# EAGLE design photodiode v1 (EAGLE 9.7.0)
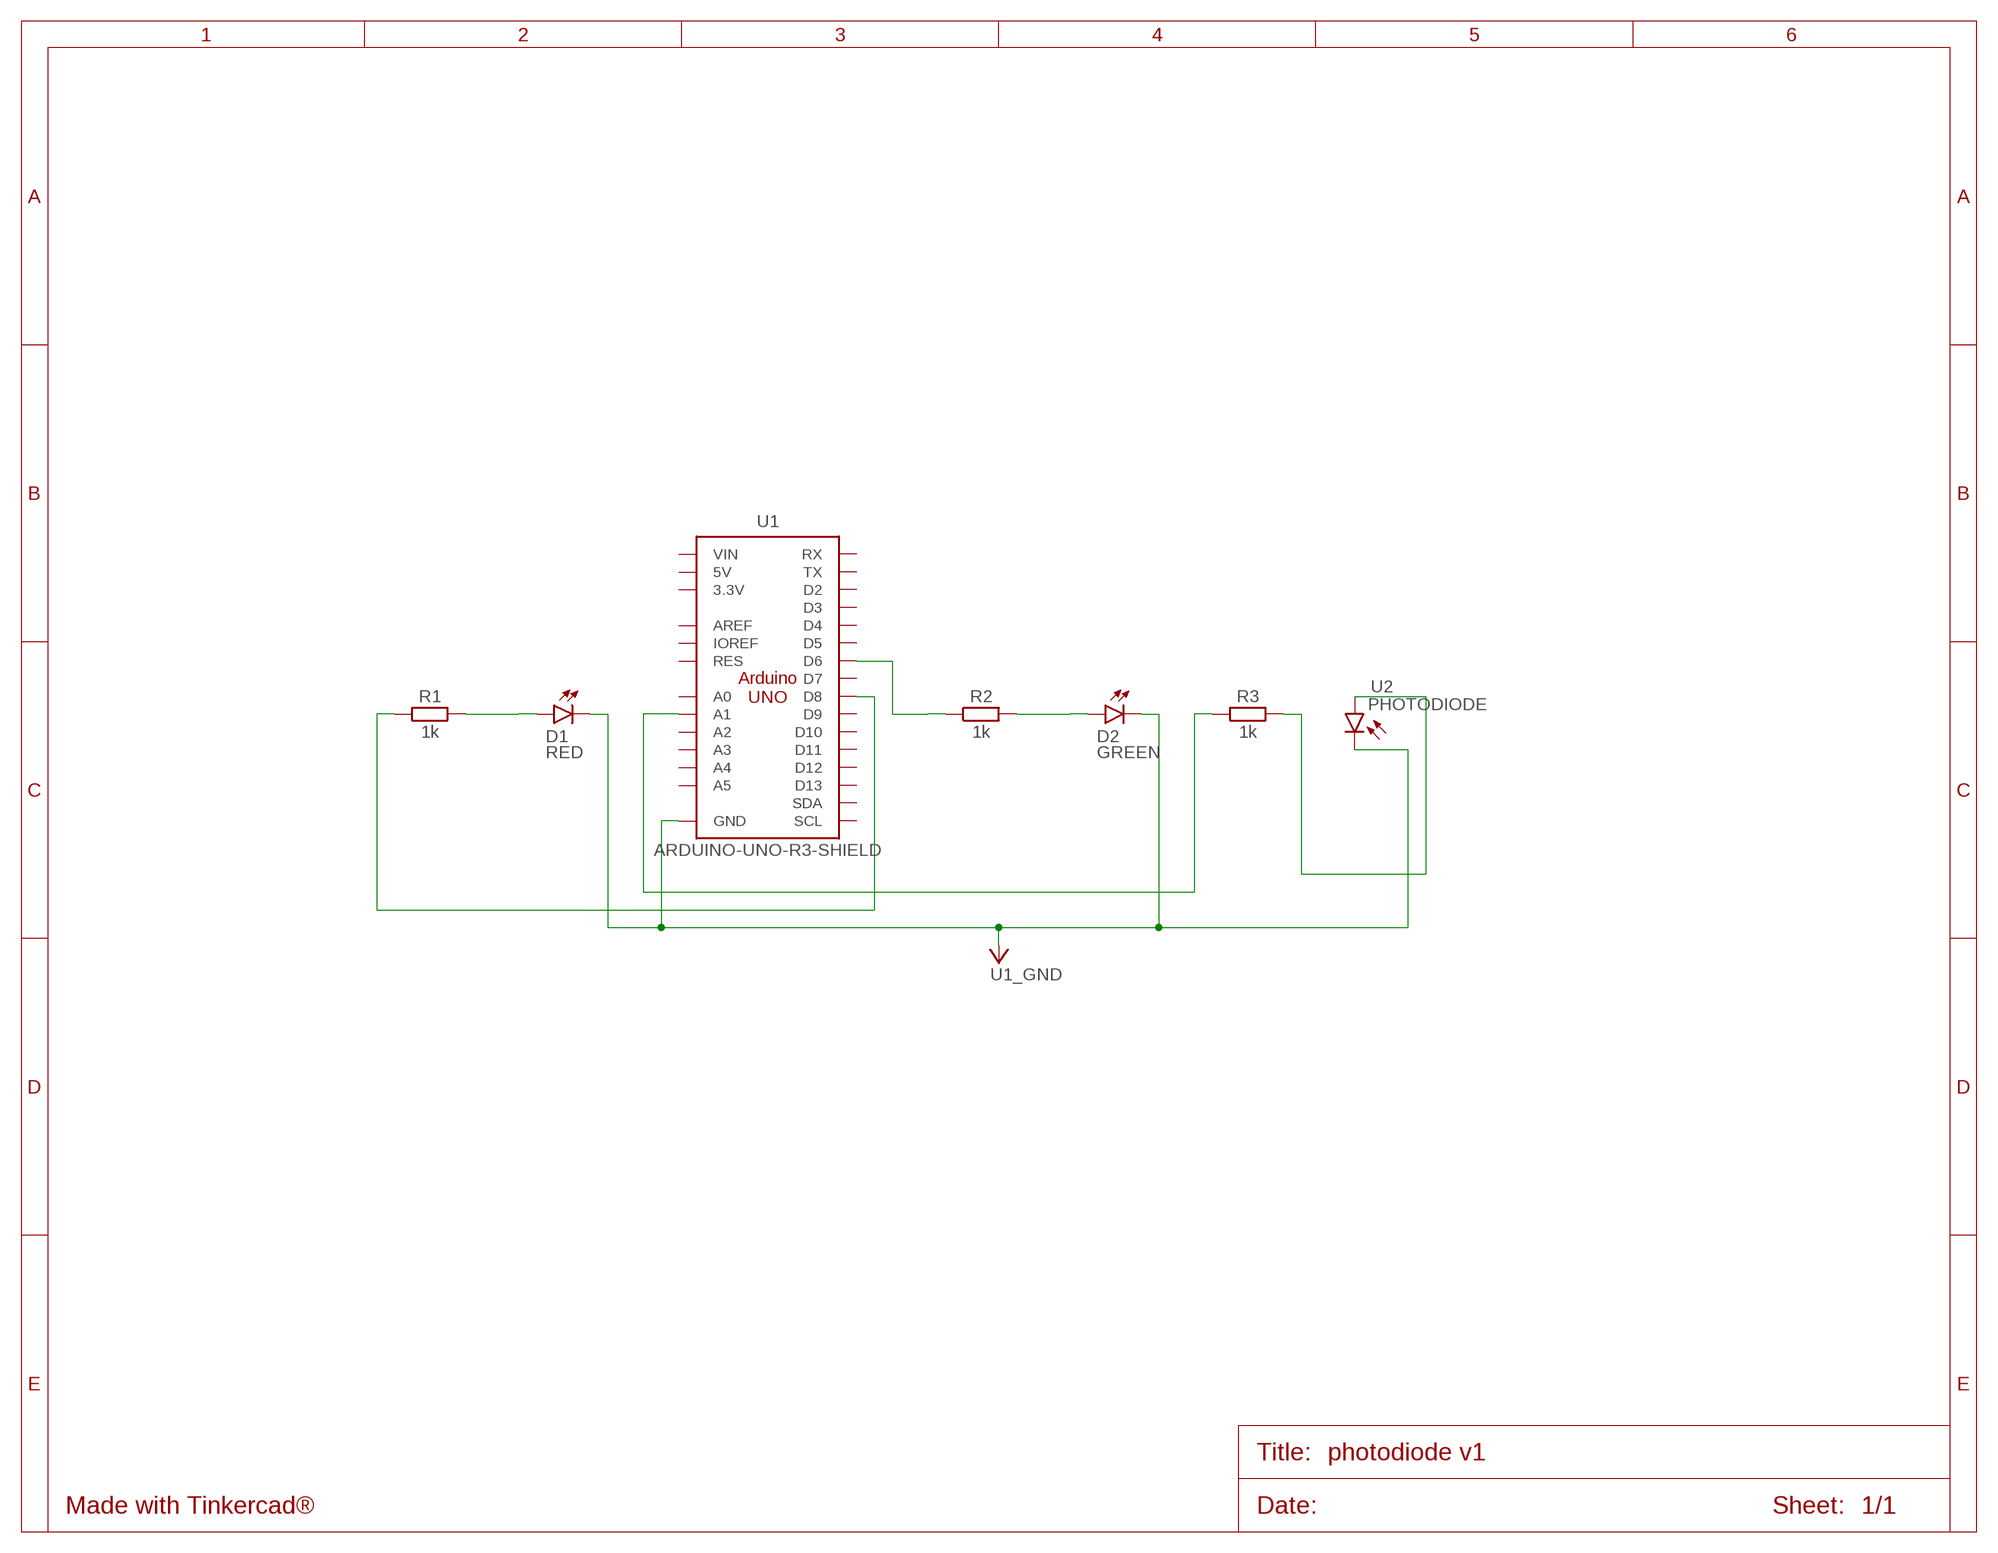
[diagram p0: schematic, sheet 1]

## Parts
D1  RED  LED_RADIAL_RED  [LEDRD254W60D565H860B]
D2  GREEN  LED_RADIAL_GREEN  [LEDRD254W60D565H860B_G]
R1  1k  RESISTOR_AXIAL-10.16MM-PITCH  [RESAD1016W63L850D250B]
R2  1k  RESISTOR_AXIAL-10.16MM-PITCH  [RESAD1016W63L850D250B]
R3  1k  RESISTOR_AXIAL-10.16MM-PITCH  [RESAD1016W63L850D250B]
U1  ARDUINO-UNO-R3-SHIELD  [ARDUINO-UNO-R3-SHIELD]
U2  PHOTODIODE  [LEDRD254W51D580H541B]

## Nets
D1_A: D1.1(A) R1.2
D2_A: D2.1(A) R2.2
U1_A1: R3.1 U1.A1
U1_D6: R2.1 U1.D6
U1_D8: R1.1 U1.D8
U1_GND: D1.2(C) D2.2(C) U1.GND@0(GND) U1.GND@1(GND) U1.GND@2(GND) U2.C
U2_A: R3.2 U2.A
Unconnected: U1.3.3V U1.5V U1.A0 U1.A2 U1.A3 U1.A4 U1.A5 U1.AREF U1.D2 U1.D3 U1.D4 U1.D5 U1.D7 U1.D9 U1.D10 U1.D11 U1.D12 U1.D13 U1.IOREF U1.RES U1.RX U1.SCL U1.SDA U1.TX U1.VIN

## Library data of the parts
D1 = Tinkercad:LED_RADIAL: LED - Generic; CATEGORY: Opto-Electronic; SUB-CATEGORY: LED; VALUE: LED_RED
D2 = Tinkercad:LED_RADIAL: LED - Generic; CATEGORY: Opto-Electronic; SUB-CATEGORY: LED; VALUE: LED_GREEN
R1-R3 = Tinkercad:RESISTOR: Resistor Fixed - Generic
U1 = Tinkercad:ARDUINO-UNO-R3-SHIELD
U2 = Tinkercad:PHOTODIODE: Photodiode Reference Datasheet <https://datasheet.octopart.com/PDB-C139-Advanced-Photonix-datasheet-146011.pdf>

## Board
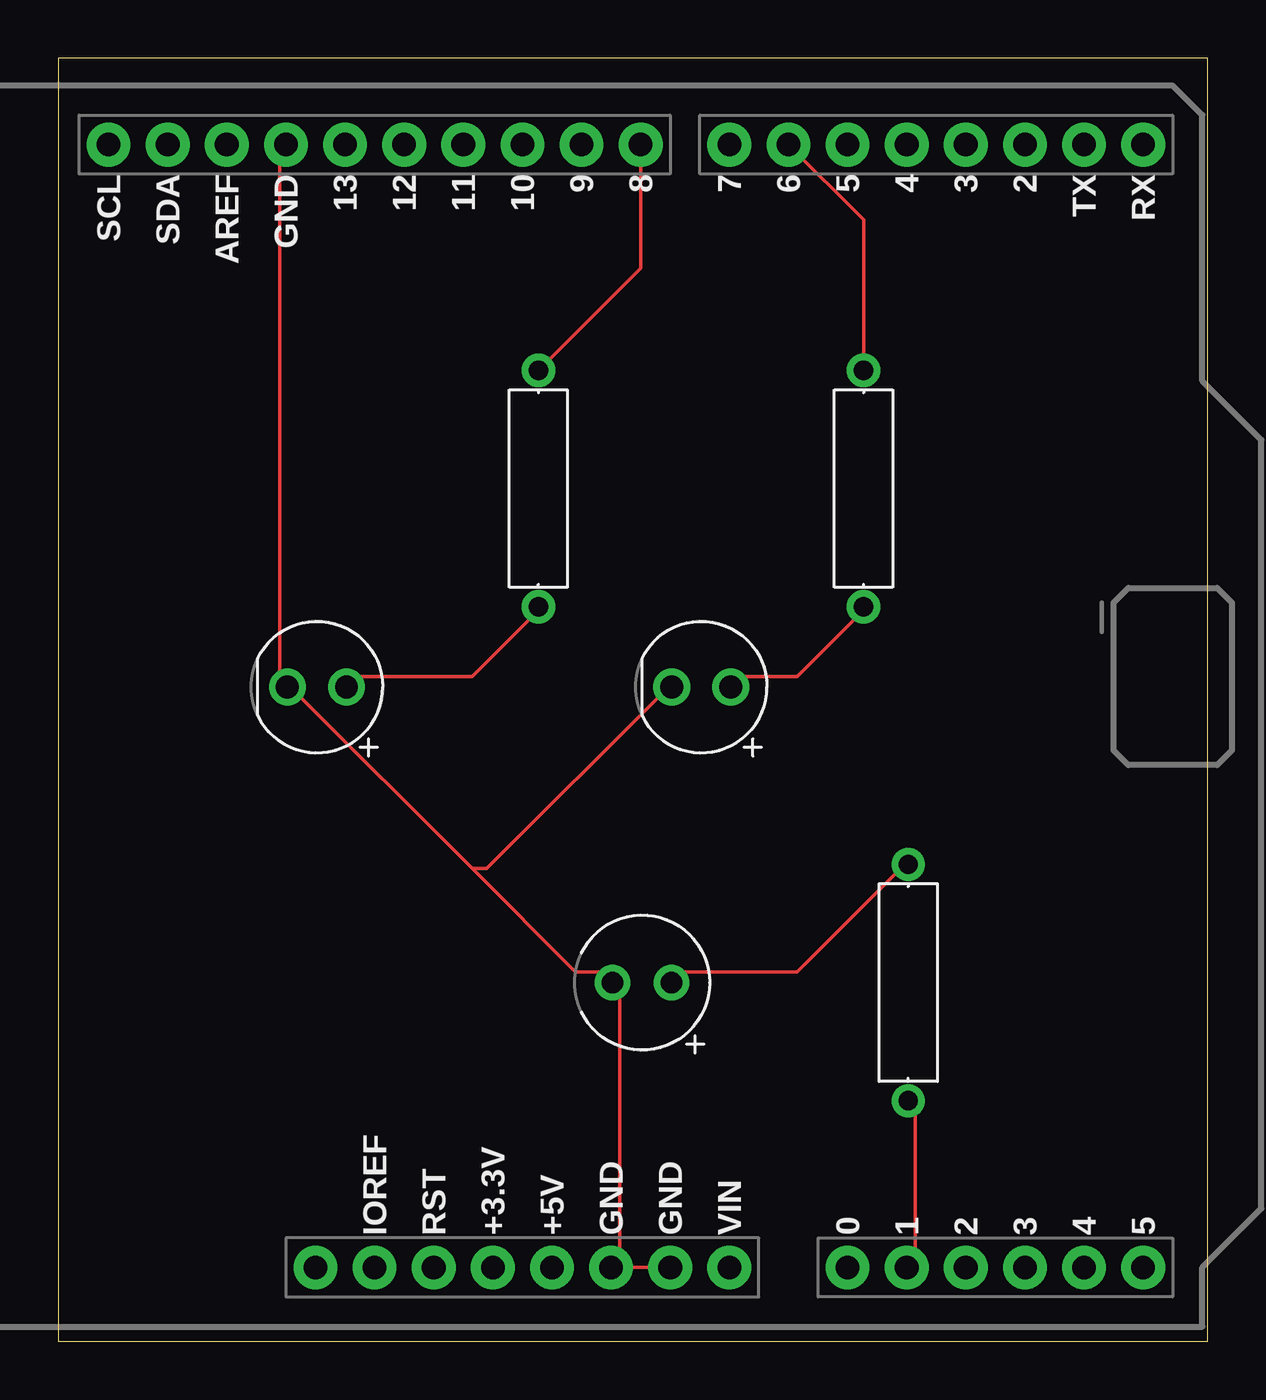
[diagram p1: board, top side]

Size 49.38 x 55.15 mm. Coordinates in mm from the lower left corner, seen from the top.
Outline: 0,0 49.38,0 49.38,55.15 0,55.15 0,0
Copper layers (1*16): Top 0.035mm / dielectric 1.5mm / Bottom 0.035mm
Design rules "default": minimum track width 6mil, minimum drill 0.35mm, track to track 6mil, track to pad 6mil, pad to pad 6mil, via to via 6mil, smd to smd 6mil, copper to edge 40mil, drill to drill 6mil, minimum pad ring 10mil, minimum via ring 8mil, stop-mask expansion 4mil, vias tented up to drill 0mil, thermal gap 10mil

### Footprints (pad centres in the part's own frame; a part is rotated, then mirrored left to right if it is on the bottom)
LEDRD254W60D565H860B = drill 0.981 pad 1.581: 1 -1.27,0; 2 1.27,0
LEDRD254W60D565H860B_G = drill 0.981 pad 1.581: 1 -1.27,0; 2 1.27,0
RESAD1016W63L850D250B = drill 0.83 pad 1.43: 1 -5.08,0; 2 5.08,0
ARDUINO-UNO-R3-SHIELD = drill 1.016 pad 1.88: 3.3V 24.13,-2.54; 5V 24.13,0; A0 24.13,12.7; A1 24.13,15.24; A2 24.13,17.78; A3 24.13,20.32; A4 24.13,22.86; A5 24.13,25.4; AREF -24.13,-13.97; D2 -24.13,20.32; D3 -24.13,17.78; D4 -24.13,15.24; D5 -24.13,12.7; D6 -24.13,10.16; D7 -24.13,7.62; D8 -24.13,3.81; D9 -24.13,1.27; D10 -24.13,-1.27; D11 -24.13,-3.81; D12 -24.13,-6.35; D13 -24.13,-8.89; GND@0 24.13,2.54; GND@1 24.13,5.08; GND@2 -24.13,-11.43; IOREF 24.13,-7.62; NC 24.13,-10.16; RES 24.13,-5.08; RX -24.13,25.4; SCL -24.13,-19.05; SDA -24.13,-16.51; TX -24.13,22.86; VIN 24.13,7.62
LEDRD254W51D580H541B = drill 0.921 pad 1.521: A -1.27,0; C 1.27,0

### Placement (x,y rotation side)
D1  11.12,28.12 180 top
D2  27.63,28.12 180 top
R1  20.63,36.65 270 top
R2  34.6,36.65 270 top
R3  36.52,15.42 90 top
U1  21.21,27.3 270 top
U2  25.09,15.42 180 top

### Tracks (layer width: path | path; a pad name or v marks a point on that pad's centre or on a via)
D1_A
  Top 0.152: R1.2 20.32,31.12 17.78,28.57 12.7,28.57 D1.1
D2_A
  Top 0.152: R2.2 34.29,31.12 31.75,28.57 29.21,28.57 D2.1
U1_A1
  Top 0.152: R3.1 36.83,10.16 36.83,3.17 U1.A1
U1_D6
  Top 0.152: U1.D6 34.6,48.21 R2.1
U1_D8
  Top 0.152: R1.1 25.02,46.12 U1.D8
U1_GND
  Top 0.152: 24.13,3.17 24.13,15.24 U2.C 23.49,15.88 22.23,15.88 17.78,20.32 | 17.78,20.32 10.16,27.94 D1.2 9.52,28.57 9.52,51.44 U1.GND@2 | 17.78,20.32 18.41,20.32 26.03,27.94 D2.2 | 24.13,3.17 U1.GND@1 | 24.13,3.17 U1.GND@0
U2_A
  Top 0.152: R3.2 36.2,20.32 31.75,15.88 26.67,15.88 U2.A